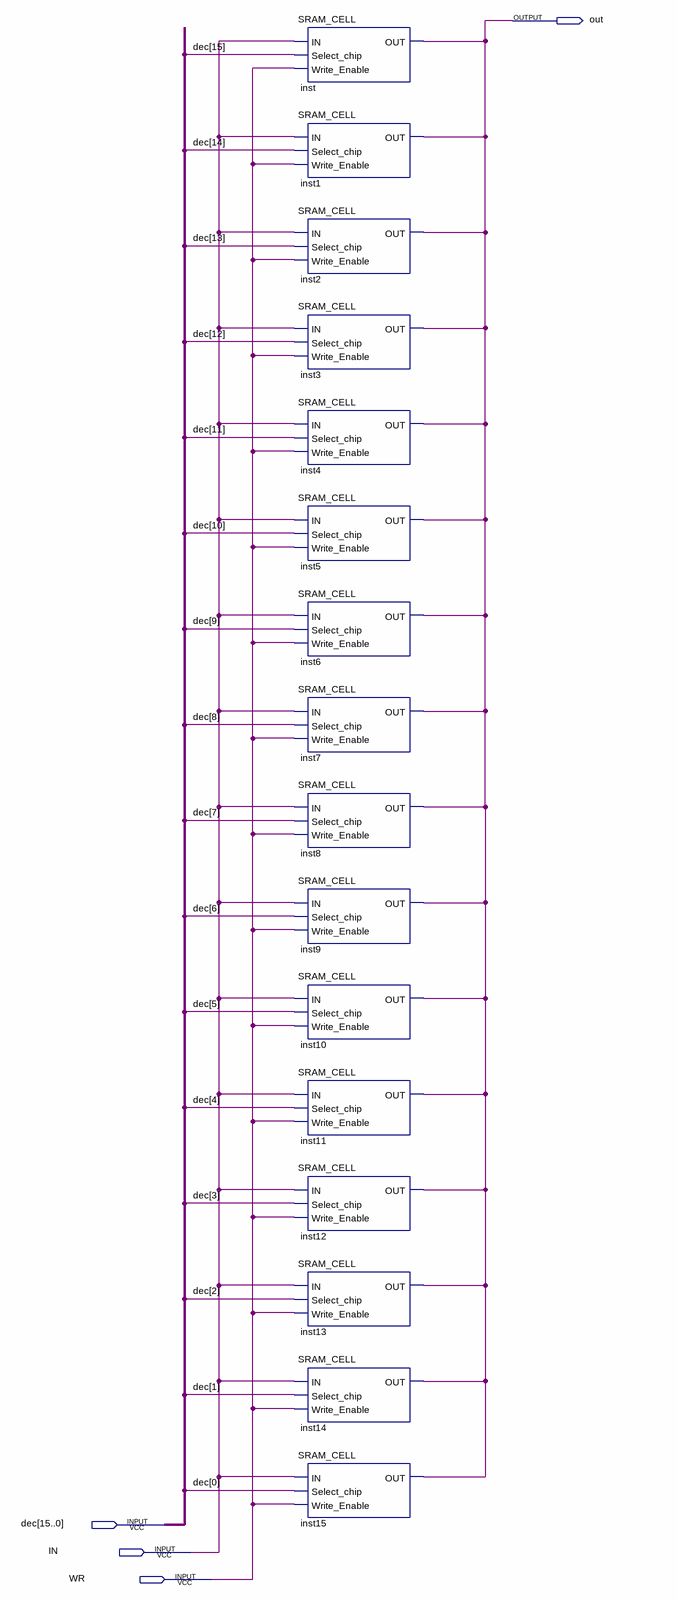
[diagram p0: schematic sheet]
// Quartus schematic SRAM_16.bdf as structural Verilog: 16 symbols, 4 pins
module SRAM_16 (
  input  [15:0] dec,
  input  IN,
  input  WR,
  output out
);

  SRAM_CELL inst (.IN(IN), .Select_chip(dec[15]), .Write_Enable(WR), .OUT(out));
  SRAM_CELL inst1 (.IN(IN), .Select_chip(dec[14]), .Write_Enable(WR), .OUT(out));
  SRAM_CELL inst2 (.IN(IN), .Select_chip(dec[13]), .Write_Enable(WR), .OUT(out));
  SRAM_CELL inst3 (.IN(IN), .Select_chip(dec[12]), .Write_Enable(WR), .OUT(out));
  SRAM_CELL inst4 (.IN(IN), .Select_chip(dec[11]), .Write_Enable(WR), .OUT(out));
  SRAM_CELL inst5 (.IN(IN), .Select_chip(dec[10]), .Write_Enable(WR), .OUT(out));
  SRAM_CELL inst6 (.IN(IN), .Select_chip(dec[9]), .Write_Enable(WR), .OUT(out));
  SRAM_CELL inst7 (.IN(IN), .Select_chip(dec[8]), .Write_Enable(WR), .OUT(out));
  SRAM_CELL inst8 (.IN(IN), .Select_chip(dec[7]), .Write_Enable(WR), .OUT(out));
  SRAM_CELL inst9 (.IN(IN), .Select_chip(dec[6]), .Write_Enable(WR), .OUT(out));
  SRAM_CELL inst10 (.IN(IN), .Select_chip(dec[5]), .Write_Enable(WR), .OUT(out));
  SRAM_CELL inst11 (.IN(IN), .Select_chip(dec[4]), .Write_Enable(WR), .OUT(out));
  SRAM_CELL inst12 (.IN(IN), .Select_chip(dec[3]), .Write_Enable(WR), .OUT(out));
  SRAM_CELL inst13 (.IN(IN), .Select_chip(dec[2]), .Write_Enable(WR), .OUT(out));
  SRAM_CELL inst14 (.IN(IN), .Select_chip(dec[1]), .Write_Enable(WR), .OUT(out));
  SRAM_CELL inst15 (.IN(IN), .Select_chip(dec[0]), .Write_Enable(WR), .OUT(out));
endmodule
